# EasyEDA schematic My_Spot_User_Interface.json
TITLE: User interface board; REV: 1.0; Date: 2023-05-03; Sheet: 1/1; Drawn By: Kincses Bendeguz; Company: Kincses
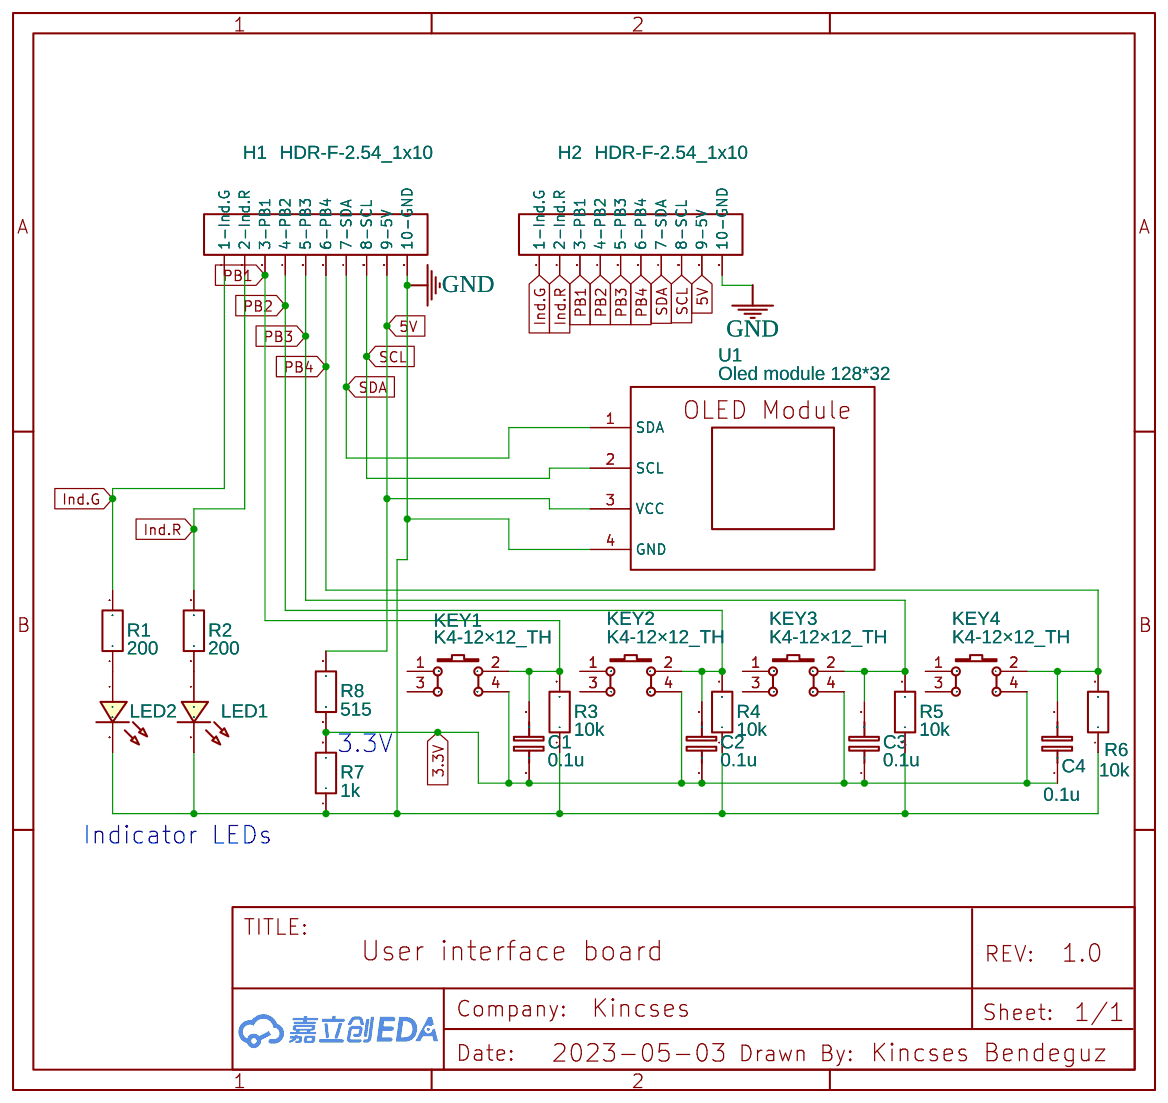
[diagram p0: schematic sheet]

## Parts
C1  0.1u  [RAD-0.1]
C2  0.1u  [RAD-0.1]
C3  0.1u  [RAD-0.1]
C4  0.1u  [RAD-0.1]
H1  HDR-F-2.54_1x10  [HDR-F-2.54_1X10]
H2  HDR-F-2.54_1x10  [HDR-F-2.54_1X10]
KEY1  K4-12×12_TH  [KEY-TH_4P-L12.0-W12.0-P5.00-LS12.5]
KEY2  K4-12×12_TH  [KEY-TH_4P-L12.0-W12.0-P5.00-LS12.5]
KEY3  K4-12×12_TH  [KEY-TH_4P-L12.0-W12.0-P5.00-LS12.5]
KEY4  K4-12×12_TH  [KEY-TH_4P-L12.0-W12.0-P5.00-LS12.5]
LED1  LED-TH-5mm_R  [LED-TH_BD5.0_RED]
LED2  LED-TH-5mm_G  [LED-TH_BD5.0_GREEN]
R1  200  [R_AXIAL-0.4]
R2  200  [R_AXIAL-0.4]
R3  10k  [R_AXIAL-0.4]
R4  10k  [R_AXIAL-0.4]
R5  10k  [R_AXIAL-0.4]
R6  10k  [R_AXIAL-0.4]
R7  1k  [R_AXIAL-0.4]
R8  515  [R_AXIAL-0.4]
U1  Oled module 128*32  [OLED 128X32]

## Library data of the parts
C1-C4 = C_RAD-0.1_EU: Contributor: LCEDA_Lib
H1 H2 = HDR-F-2.54_1x10: Supplier Part: C35445; Supplier: LCSC; Contributor: LCEDA_Lib; Package Display: No
KEY1-KEY4 = K4-12×12_TH: Supplier Part: C128053; Supplier: LCSC; Manufacturer: 韩国韩荣; Manufacturer Part: K2-1103DP-M4SW-04; Contributor: LCEDA_Lib
LED1 = LED-TH-5mm_R: Manufacturer: EVERLIGHT(台湾亿光); Manufacturer Part: 333-2SURD/S530-A3; Supplier Part: C87271; Supplier: LCSC; Contributor: LCEDA_Lib
LED2 = LED-TH-5mm_G: Manufacturer: EVERLIGHT(台湾亿光); Manufacturer Part: 333-2SYGD/S530-E2; Supplier Part: C88163; Supplier: LCSC; Contributor: LCEDA_Lib
R1-R8 = R_AXIAL-0.4_EU: Contributor: LCEDA_Lib
U1 = Oled module 128*32: Contributor: Benulino

## Nets
3.3V: C1.1 C2.1 C3.1 C4.1 KEY1.4(3) KEY2.4(3) KEY3.4(3) KEY4.4(3) R7.2 R8.1
5V: H1.9(9-5V) H2.9(9-5V) R8.2 U1.3(VCC)
GND: H1.10(10-GND) H2.10(10-GND) LED1.2 LED2.2 R3.1 R4.1 R5.1 R6.1 R7.1 U1.4(GND)
Ind.G: H1.1(1-Ind.G) H2.1(1-Ind.G) R1.2
Ind.R: H1.2(2-Ind.R) H2.2(2-Ind.R) R2.2
PB1: C1.2 H1.3(3-PB1) H2.3(3-PB1) KEY1.2(4) R3.2
PB2: C2.2 H1.4(4-PB2) H2.4(4-PB2) KEY2.2(4) R4.2
PB3: C3.2 H1.5(5-PB3) H2.5(5-PB3) KEY3.2(4) R5.2
PB4: C4.2 H1.6(6-PB4) H2.6(6-PB4) KEY4.2(4) R6.2
SCL: H1.8(8-SCL) H2.8(8-SCL) U1.2(SCL)
SDA: H1.7(7-SDA) H2.7(7-SDA) U1.1(SDA)
Net-(LED1-1): LED1.1 R2.1
Net-(LED2-1): LED2.1 R1.1

Not connected (* = marked no-connect by the designer): KEY1 1(2) 3(1); KEY2 1(2) 3(1); KEY3 1(2) 3(1); KEY4 1(2) 3(1)

## Notes on the sheet
- 3.3V
- Indicator LEDs
